# Altium schematic sheet RS232_Level_Shifter.SchDoc
size A
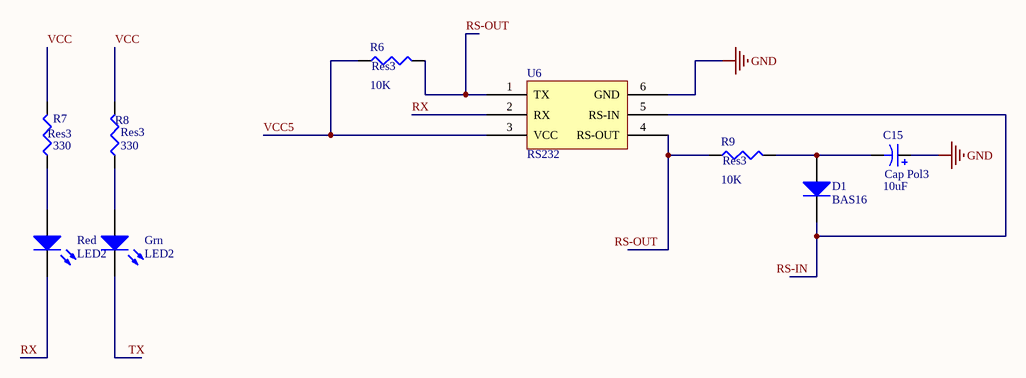
[diagram p0: RS232_Level_Shifter.SchDoc]

## Parts
C15  Cap Pol3  value 10uF  [C0805]
D1  BAS16  [SMC]
Grn  LED2  [3.2X1.6X1.1]
R6  Res3  value 10K  [J1-0603]
R7  Res3  value 330  [J1-0603]
R8  Res3  value 330  [J1-0603]
R9  Res3  value 10K  [J1-0603]
Red  LED2  [3.2X1.6X1.1]
U6  RS232  [rs232]

## Nets
GND: C15.1 U6.6(GND)
RS-OUT: R6.2 U6.1(TX)
RX: Red.2(K) U6.2(RX)
TX: Grn.2(K)
VCC: R7.2 R8.2
VCC5: R6.1 U6.3(VCC)
NetC15_2: C15.2 D1.1(A) R9.2
NetD1_2: D1.2(K) U6.5(RS-IN)
NetGrn_1: Grn.1(A) R8.1
NetR7_1: R7.1 Red.1(A)
NetR9_1: R9.1 U6.4(RS-OUT)

## Notes on the sheet
- Labels drawn without touching a wire or pin: RS-IN, RS-OUT

## Library data of the parts
C15 = Cap Pol3: Polarized Capacitor (Surface Mount); Published: 8-Jun-2000; LatestRevisionDate: 29-May-2009; LatestRevisionNote: IPC-7351 Footprint Added.; PackageReference: C0805; Publisher: Altium Limited; PackageDescription: Chip Capacitor
D1 = Diode: Default Diode; Published: 8-Jun-2000; LatestRevisionDate: 17-Jul-2002; LatestRevisionNote: Re-released for DXP Platform.; PackageVersion: Sep-1996; PackageReference: SMC; Publisher: Altium Limited; PackageDescription: DO-214-AB/SMC; 2 C-Bend Leads; Body 7.9 x 5.9 mm, inc. leads (LxW); Code_JEDEC: DO-214-AB
Grn Red = LED2: Typical RED, GREEN, YELLOW, AMBER GaAs LED; Published: 8-Jun-2000; LatestRevisionDate: 17-Jul-2002; LatestRevisionNote: Re-released for DXP Platform.; PackageVersion: Feb-2002; PackageReference: 3.2X1.6X1.1; Publisher: Altium Limited; PackageDescription: SM LED; 2 Flat Leads
R6-R9 = Res3: Resistor; Published: 8-Jun-2000; LatestRevisionDate: 29-May-2009; LatestRevisionNote: IPC-7351 Footprint Added.; PackageReference: J1-0603; Publisher: Altium Limited; PackageDescription: Chip Resistor